# EAGLE design usbport-power-controller (EAGLE 9.6.2)
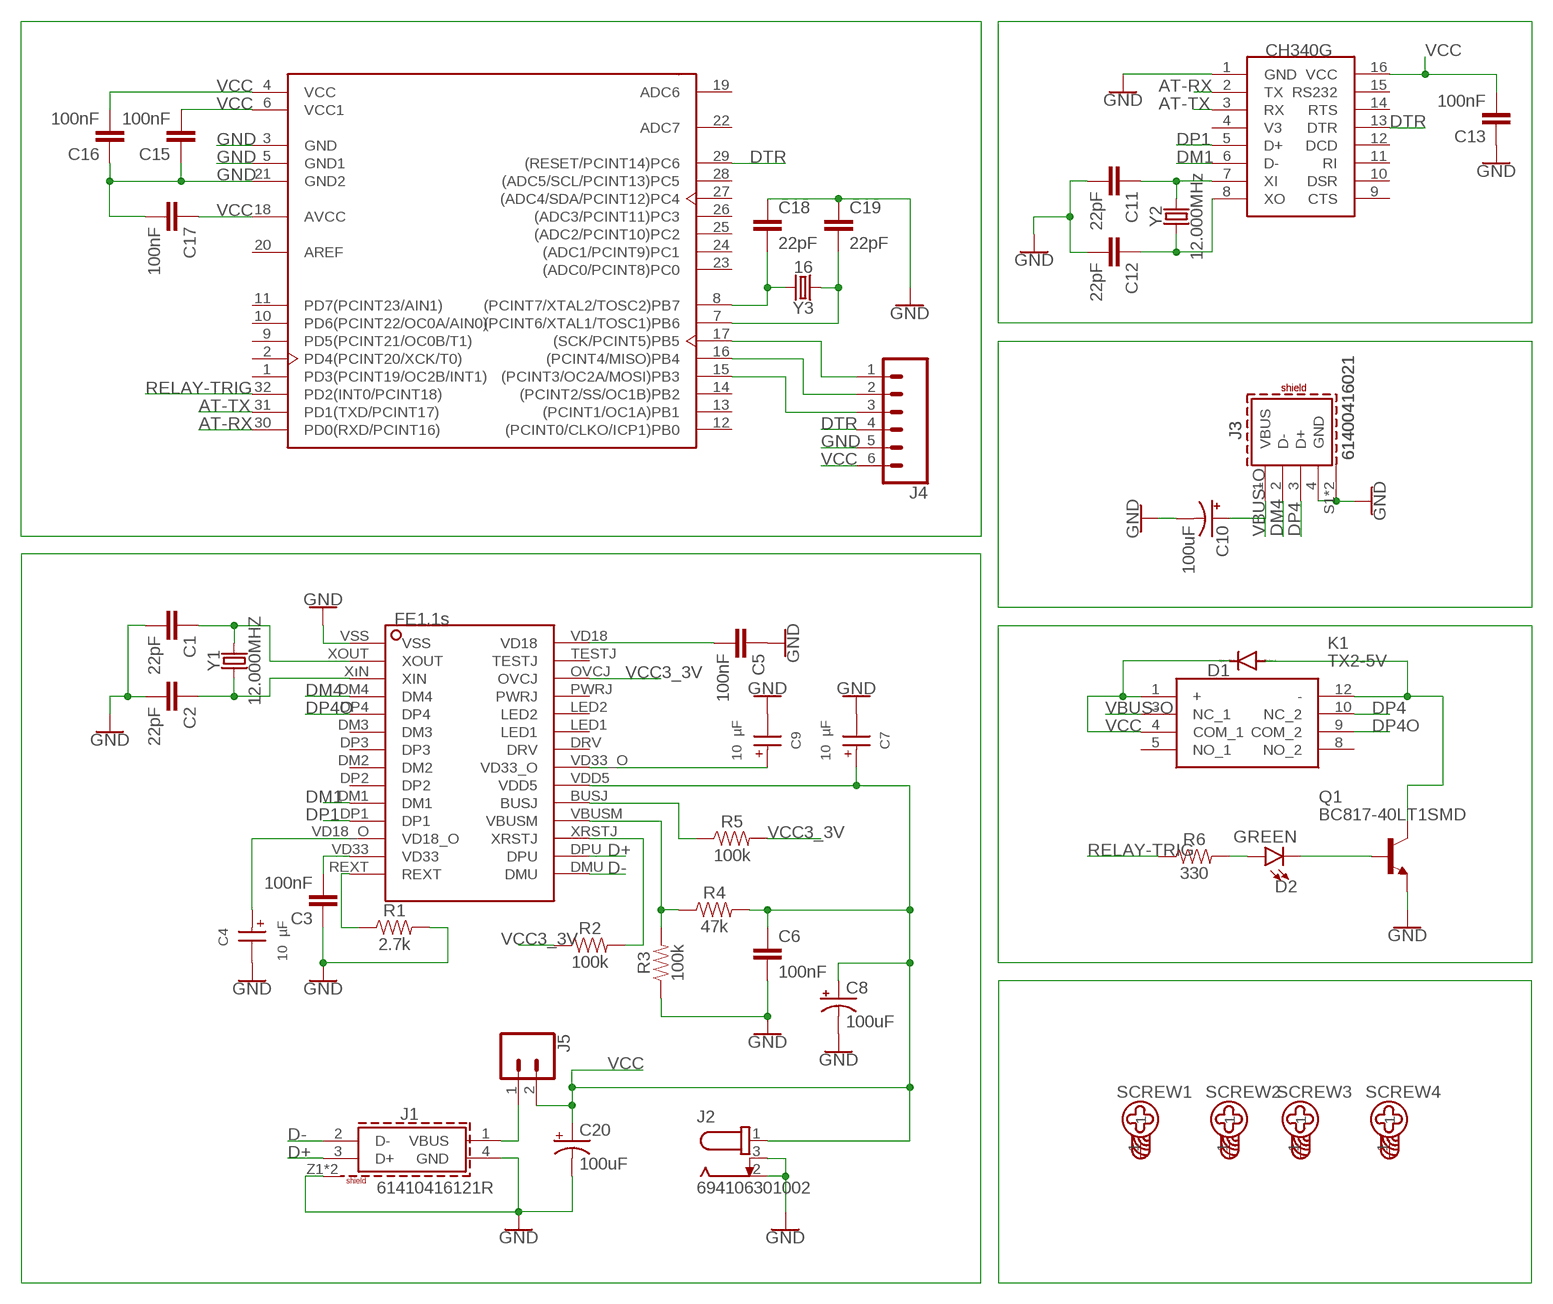
[diagram p0: schematic, sheet 1]

## Parts
ATMEGA328P-AU  ATMEGA328P-AU  [TQFP-32]
C1  22pF  10UF-1206-6.3V-20%  [1206]
C2  22pF  10UF-1206-6.3V-20%  [1206]
C3  100nF  1.0UF-1206-50V-10%  [1206]
C4  10 µF  WCAP-ASLI_4X5.5_865080340001  [WCAP-ASLI_4X5.5(DXL)]
C5  100nF  1.0UF-1206-50V-10%  [1206]
C6  100nF  1.0UF-1206-50V-10%  [1206]
C7  10 µF  WCAP-ASLI_4X5.5_865080340001  [WCAP-ASLI_4X5.5(DXL)]
C8  100uF  100UF-POLAR-25V-20%(ELEC)  [PANASONIC_D]
C9  10 µF  WCAP-ASLI_4X5.5_865080340001  [WCAP-ASLI_4X5.5(DXL)]
C10  100uF  100UF-POLAR-25V-20%(ELEC)  [PANASONIC_D]
C11  22pF  10UF-1206-6.3V-20%  [1206]
C12  22pF  10UF-1206-6.3V-20%  [1206]
C13  100nF  1.0UF-1206-50V-10%  [1206]
C15  100nF  1.0UF-1206-50V-10%  [1206]
C16  100nF  1.0UF-1206-50V-10%  [1206]
C17  100nF  1.0UF-1206-50V-10%  [1206]
C18  22pF  10UF-1206-6.3V-20%  [1206]
C19  22pF  10UF-1206-6.3V-20%  [1206]
C20  100uF  100UF-POLAR-25V-20%(ELEC)  [PANASONIC_D]
D1  DIODE-DO-214AC  [DO-214AC]
D2  GREEN  LED-GREEN1206  [LED-1206]
J1  61410416121R  [61410416121R]
J2  694106301002  [694106301002]
J3  61400416021  61400416021  [61400416021]
J4  CONN_06NO_SILK_FEMALE_PTH  [1X06_NO_SILK]
J5  CONN_02  [1X02]
K1  TX2-5V  [TX2-24V]
Q1  BC817-40LT1SMD  [SOT23-BEC]
R1  2.7k  RESISTOR1206  [1206]
R2  100k  RESISTOR1206  [1206]
R3  100k  RESISTOR1206  [1206]
R4  47k  RESISTOR1206  [1206]
R5  100k  RESISTOR1206  [1206]
R6  330  10OHM-1206-1/4W-1%  [1206]
SCREW1  4946  [4946]
SCREW2  4946  [4946]
SCREW3  4946  [4946]
SCREW4  4946  [4946]
U$1  FE1.1S  [FE1.1S]
U$2  CH340G  [SOIC16]
Y1  12.000MHZ  CRYSTALSMD-HC49UP  [HC49UP]
Y2  12.000MHz  CRYSTALSMD-HC49UP  [HC49UP]
Y3  16  CRYSTALSMD-HC49UP  [HC49UP]

## Nets
AT-RX: ATMEGA328P-AU.30(PD0(RXD/PCINT16)) U$2.2(TX)
AT-TX: ATMEGA328P-AU.31(PD1(TXD/PCINT17)) U$2.3(RX)
D+: J1.3(D+) U$1.DPU
D-: J1.2(D-) U$1.DMU
DM1: U$1.DM1 U$2.6(D-)
DM4: J3.2(D-) U$1.DM4
DP1: U$1.DP1 U$2.5(D+)
DP4: J3.3(D+) K1.10(NC_2)
DP4O: K1.9(COM_2) U$1.DP4
DTR: ATMEGA328P-AU.29((RESET/PCINT14)PC6) J4.4 U$2.13(DTR)
GND: ATMEGA328P-AU.3(GND) ATMEGA328P-AU.5(GND1) ATMEGA328P-AU.21(GND2) C1.2 C2.2 C3.1 C4.2(-) C5.1 C6.2 C7.2(-) C8.- C9.2(-) C10.- C11.2 C12.2 C13.1 C15.1 C16.1 C17.2 C18.1 C19.1 C20.- J1.4(GND) J1.Z1(SHIELD) J1.Z2(SHIELD) J2.2 J2.3 J3.4(GND) J3.S1(SHIELD) J3.S2(SHIELD) J4.5 Q1.E R1.2 R3.1 U$1.VSS U$2.1(GND)
N$1: C2.1 U$1.XıN(XIN) Y1.1
N$2: R2.2 U$1.XRSTJ
N$3: R3.2 R4.1 U$1.VBUSM
N$4: R1.1 U$1.REXT
N$5: C1.1 U$1.XOUT Y1.2
N$6: C3.2 U$1.VD33
N$7: R5.1 U$1.BUSJ
N$8: D1.A K1.12(-) Q1.C
N$9: C12.1 U$2.8(XO) Y2.1
N$10: C4.1(+) U$1.VD18_O
N$11: C11.1 U$2.7(XI) Y2.2
N$12: D2.C Q1.B
N$13: D2.A R6.2
N$14: ATMEGA328P-AU.8((PCINT7/XTAL2/TOSC2)PB7) C18.2 Y3.2
N$15: ATMEGA328P-AU.17((SCK/PCINT5)PB5) J4.1
N$16: ATMEGA328P-AU.7((PCINT6/XTAL1/TOSC1)PB6) C19.2 Y3.1
N$17: ATMEGA328P-AU.16((PCINT4/MISO)PB4) J4.2
N$18: ATMEGA328P-AU.15((PCINT3/OC2A/MOSI)PB3) J4.3
N$20: J1.1(VBUS) J5.1
N$21: C5.2 U$1.VD18
RELAY-TRIG: ATMEGA328P-AU.32(PD2(INT0/PCINT18)) R6.1
VBUS-O: C10.+ J3.1(VBUS) K1.3(NC_1)
VCC: ATMEGA328P-AU.4(VCC) ATMEGA328P-AU.6(VCC1) ATMEGA328P-AU.18(AVCC) C6.1 C7.1(+) C8.+ C13.2 C15.2 C16.2 C17.1 C20.+ D1.C J2.1 J4.6 J5.2 K1.1(+) K1.4(COM_1) R4.2 U$1.VDD5 U$2.16(VCC)
VCC3_3V: C9.1(+) R2.1 R5.2 U$1.OVCJ U$1.VD33_O
Unconnected: ATMEGA328P-AU.1(PD3(PCINT19/OC2B/INT1)) ATMEGA328P-AU.2(PD4(PCINT20/XCK/T0)) ATMEGA328P-AU.9(PD5(PCINT21/OC0B/T1)) ATMEGA328P-AU.10(PD6(PCINT22/OC0A/AIN0)) ATMEGA328P-AU.11(PD7(PCINT23/AIN1)) ATMEGA328P-AU.12((PCINT0/CLKO/ICP1)PB0) ATMEGA328P-AU.13((PCINT1/OC1A)PB1) ATMEGA328P-AU.14((PCINT2/SS/OC1B)PB2) ATMEGA328P-AU.19(ADC6) ATMEGA328P-AU.22(ADC7) ATMEGA328P-AU.23((ADC0/PCINT8)PC0) ATMEGA328P-AU.24((ADC1/PCINT9)PC1) ATMEGA328P-AU.25((ADC2/PCINT10)PC2) ATMEGA328P-AU.26((ADC3/PCINT11)PC3) ATMEGA328P-AU.27((ADC4/SDA/PCINT12)PC4) ATMEGA328P-AU.28((ADC5/SCL/PCINT13)PC5) K1.5(NO_1) K1.8(NO_2) SCREW1.1 SCREW2.1 SCREW3.1 SCREW4.1 U$1.DM2 U$1.DM3 U$1.DP2 U$1.DP3 U$1.DRV U$1.LED1 U$1.LED2 U$1.PWRJ U$1.TESTJ U$2.4(V3) U$2.9(CTS) U$2.10(DSR) U$2.11(RI) U$2.12(DCD) U$2.14(RTS) U$2.15(RS232)

## Power pins joined to a net without a drawn wire
AREF: ATMEGA328P-AU.20(AREF)

## Library data of the parts
ATMEGA328P-AU = Microcontroller:ATMEGA328P-AU: IC MCU 8BIT 32KB FLASH 32TQFP Manufacturer's datasheet <http://ww1.microchip.com/downloads/en/DeviceDoc/ATmega48A-PA-88A-PA-168A-PA-328-P-DS-DS40002061A.pdf>; CREATED_BY: PCBLayout.com; DIGIKEY_PART_NUMBER: ATMEGA328P-AU-ND; MANUFACTURER: Microchip Technology; MPN: ATMEGA328P-AU; PACKAGE: TQFP-32
C1 C2 C11 C12 C18 C19 = SparkFun-Capacitors:10UF: 10.0µF ceramic capacitors A capacitor is a passive two-terminal electrical component used to store electrical energy temporarily in an electric field.; PROD_ID: CAP-10057; VALUE: 10uF
C3 C5 C6 C13 C15-C17 = SparkFun-Capacitors:1.0UF: 1µF ceramic capacitors A capacitor is a passive two-terminal electrical component used to store electrical energy temporarily in an electric field.; PROD_ID: CAP-09822; VALUE: 1.0uF
C4 C7 C9 = 865080340001_Eagle_WCAP-ASLI_rev20a:WCAP-ASLI_4X5.5: WCAP-ASLI Aluminium Electrolytic Capacitors Low Impedance +105 °C Characteristics Low impedance product series Mounting style: V-Chip SMT Capacitance range: 0.1 µF ‒ 6800 µF Capacitance tolerance: ±20 % Voltage range (UR): 6.3 ‒ 100 V(DC) Operating temperature: -55 °C up to +105 °C Endurance: 2000 h @ +105 °C Dimensions (DxL) in mm: 4.0 x 5.5 up to 16.0 x 17.0 Recommended soldering: Reflow soldering Applications Low impedance, especially for filtering applications Input and output capacitor for switched-mode power supply Filtering Smoothing e.g. DC/DC converter, AC/DC converter, satellite receiver, control panel <https://www.we-online.com/catalog/media/o14723v209%20Family_WCAP-ASLI.jpg> Details see: https://www.we-online.com/catalog/en/WCAP-ASLI/ Updated by yingchun,Shan;2020-03-02 2020(C) Würth Elektronik; DATASHEET-URL: https://www.we-online.com/catalog/datasheet/865080340001.pdf; DF: 16%; DIAMETER: 4mm; I-LEAK: 3uA; I-RIPPLE: 80mA; L: 5.5mm; OPERATING-TEMPERATURE: -55 °C up to +105 °C; PART-NUMBER: 865080340001; TECHNICAL-REFERENCE: ASEB055100M016DVCTAB000; VR: 16V(DC)
C8 C10 C20 = SparkFun-Capacitors:100UF-POLAR: 100µF polarized capacitors A capacitor is a passive two-terminal electrical component used to store electrical energy temporarily in an electric field.; PROD_ID: CAP-12547
D1 = diode:DIODE-: DIODE
D2 = SparkFun-LED:LED-GREEN: Green SMD LED Used in manufacturing of various products at SparkFun Packages: 0603 - SMD 0603 package [Product Link] <http://www.futureelectronics.com/en/technologies/semiconductors/optoelectronics/leds/Pages/9894312-LTST-C190GKT.aspx?CrossPart=HSMG-C190&IM=0> LilyPad 1206 - SMD1206 LilyPad package [Product Link] <http://www.futureelectronics.com/en/Technologies/Product.aspx?ProductID=IN150NGHARVATEKCORPORATION2049943&IM=0> 1206 - SMD1206 package [Product Link] <http://www.futureelectronics.com/en/technologies/semiconductors/optoelectronics/leds/Pages/8315665-LTST-C150KGKT.aspx?IM=0> 1206 Bottom Mount -SMD 1206 Bottom Mount [Product Link] <http://www.digikey.com/product-detail/en/lite-on-inc/LTST-C230KGKT/160-1456-1-ND/386854> SparkFun Products: Pro Mini 328 -5V <https://www.sparkfun.com/products/821> RedBoard <https://www.sparkfun.com/products/12757> MP3 Trigger <https://www.sparkfun.com/products/13720> Makey Makey <https://www.sparkfun.com/products/11076>; PROD_ID: DIO-00862
J1 = Wurth_Connectors_WR-USB:61410416121R: WR-COM USB 2.0 Type B Horizontal THR Kind Properties Durability:1 500 Mating cycles Quality Class:1 500 Mating cycles Connector Type: USB 2.0 Gender:Receptacle Type:Horizontal General Information Operating Temperature:-55up to +85 °C Compliance:Lead free / RoHS Electrical Properties IR 1:1.5A Working Voltage:30V (AC) Withstanding Voltage:500V (AC) Contact Resistance:30 mΩ Material Properties Insulator Material:LCP Insulator Flammability Rating:UL94 V-0 Color:Black Contact Material:Copper Alloy Contact Plating: Selective Gold Contact Type:Stamped Shielding Material:Brass Shielding Plating:Nickel <https://www.we-online.com/catalog/media/o106784v209%20Family_WR-COM_61410416121R.jpg> Details see: https://www.we-online.com/catalog/en/COM_THR_TYPE_B_HORIZONTAL/ Updated by Ella Wu 2020-08-17 2020 (C) Würth Elektronik; APPLICATION: USB 2.0; DATASHEET-URL: https://www.we-online.com/catalog/datasheet/61410416121R.pdf; GERDER: Receptacle; INTERFACE-TYPE: Type B; IR1: 1.5A; MOUNT: THR; PACKAGING: Tape and Reel; PART-NUMBER: 61410416121R; PINS: 4; TYPE: Horizontal; WORKING-VOLTAGE: 30V(AC)
J2 = DC Power Jacks:694106301002: CONN PWR JACK 2.1X5.5MM SOLDER Manufacturer's datasheet <https://katalog.we-online.de/em/datasheet/6941xx301002.pdf>; CREATED_BY: PCBLayout.com; DIGIKEY_PART_NUMBER: 732-5930-ND; MANUFACTURER: Wurth Electronics Inc.; MPN: 694106301002
J3 = Wurth_Connectors_WR-USB:61400416021: WR-COM USB 2.0 Type A Horizontal Kind Properties Durability:1 500 Mating cycles Quality Class:1 500 Mating cycles Connector Type:USB Gender:Receptacle Type:Horizontal General Information Operating Temperature:-40up to +105 °C Compliance:RoHS Electrical Properties IR 1:1.5 A Working Voltage:30V (AC) Withstanding Voltage:750 V (AC) Contact Resistance:20 mΩ Material Properties Insulator Material:PBT Insulator Flammability Rating:UL94 V-0 Color:White Cover Material:Brass Cover Plating:Nickel Contact Material:Copper Alloy Contact Plating:Selective Gold Contact Type:Stamped Shielding Material:Brass Shielding Plating:Nickel <https://www.we-online.com/catalog/media/o32983v209%20Family_WR-COM_61400416021.jpg> Details see: https://www.we-online.com/catalog/en/COM_TYPE_A_HORIZONTAL/ Updated by Yingchun, Shan 2020-01-14 2020 (C) Würth Elektronik; APPLICATION: USB 2.0; DATASHEET-URL: https://www.we-online.com/catalog/datasheet/61400416021.pdf; GERDER: Receptacle; INTERFACE-TYPE: Type A; IR1: 1.5A; MOUNT: THT; PACKAGING: Tray; PART-NUMBER: 61400416021; PINS: 4; TYPE: Horizontal; WORKING-VOLTAGE: 30V(AC)
J4 = SparkFun-Connectors:CONN_06: Multi connection point. Often used as Generic Header-pin footprint for 0.1 inch spaced/style header connections On any of the 0.1 inch spaced packages, you can populate with these: Break Away Headers - Straight <https://www.sparkfun.com/products/116> (PRT-00116) Break Away Male Headers - Right Angle <https://www.sparkfun.com/products/553> (PRT-00553) Female Headers <https://www.sparkfun.com/products/115> (PRT-00115) Break Away Headers - Machine Pin <https://www.sparkfun.com/products/117> (PRT-00117) Break Away Female Headers - Swiss Machine Pin <https://www.sparkfun.com/products/743> (PRT-00743) Arduino Stackable Header - 6 Pin <https://www.sparkfun.com/products/9280> (PRT-09280) For SCREWTERMINALS and SPRING TERMINALS visit here: Screw Terimnals on SparkFun.com <https://www.sparkfun.com/search/results?term=Screw+Terminals> (5mm/3.5mm/2.54mm spacing) This device is also useful as a general connection point to wire up your design to another part of your project. Our various solder wires solder well into these plated through hole pads. Hook-Up Wire - Assortment (Stranded, 22 AWG) <https://www.sparkfun.com/products/11375> (PRT-11375) Hook-Up Wire - Assortment (Solid Core, 22 AWG) <https://www.sparkfun.com/products/11367> (PRT-11367) View the entire wire category on our website here <https://www.sparkfun.com/categories/141>; PROD_ID: CONN-08437
J5 = SparkFun-Connectors:CONN_02: Multi connection point. Often used as Generic Header-pin footprint for 0.1 inch spaced/style header connections On any of the 0.1 inch spaced packages, you can populate with these: Break Away Headers - Straight <https://www.sparkfun.com/products/116> (PRT-00116) Break Away Male Headers - Right Angle <https://www.sparkfun.com/products/553> (PRT-00553) Female Headers <https://www.sparkfun.com/products/115> (PRT-00115) Break Away Headers - Machine Pin <https://www.sparkfun.com/products/117> (PRT-00117) Break Away Female Headers - Swiss Machine Pin <https://www.sparkfun.com/products/743> (PRT-00743) For SCREWTERMINALS and SPRING TERMINALS visit here: Screw Terimnals on SparkFun.com <https://www.sparkfun.com/search/results?term=Screw+Terminals> (5mm/3.5mm/2.54mm spacing) This device is also useful as a general connection point to wire up your design to another part of your project. Our various solder wires solder well into these plated through hole pads. Hook-Up Wire - Assortment (Stranded, 22 AWG) <https://www.sparkfun.com/products/11375> (PRT-11375) Hook-Up Wire - Assortment (Solid Core, 22 AWG) <https://www.sparkfun.com/products/11367> (PRT-11367) View the entire wire category on our website here <https://www.sparkfun.com/categories/141> Special notes: Molex polarized connector foot print use with: PRT-08233 with associated crimp pins and housings. 2.54_SCREWTERM for use with PRT-10571. 3.5mm Screw Terminal footprints for PRT-08084 5mm Screw Terminal footprints for use with PRT-08432
K1 = TX2-5V:TX2-5V: Low Signal Relays - PCB 2A 5VDC DPDT NON-LATCHING PCB Source: Datasheet <https://www.panasonic-electric-works.com/pew/hu/downloads/ds_61022_en_tx.pdf>; DESCRIPTION: Low Signal Relays - PCB 2A 5VDC DPDT NON-LATCHING PCB; HEIGHT: mm; MANUFACTURER_NAME: Panasonic; MANUFACTURER_PART_NUMBER: TX2-5V; MOUSER_PART_NUMBER: 769-TX2-5V; MOUSER_PRICE-STOCK: https://www.mouser.co.uk/ProductDetail/Panasonic-Industrial-Devices/TX2-5V?qs=HLLy2pIPwuvI6H6PvuEgKw%3D%3D
Q1 = transistor-npn:BC817*: NPN Transistor
R1-R5 = SparkFun-Resistors:RESISTOR: Generic Resistor Package
R6 = SparkFun-Resistors:10OHM: 10Ω resistor A resistor is a passive two-terminal electrical component that implements electrical resistance as a circuit element. Resistors act to reduce current flow, and, at the same time, act to lower voltage levels within circuits. - Wikipedia; PROD_ID: RES-08705; VALUE: 10
SCREW1-SCREW4 = PlasticScrew:4946: Standoffs & Spacers M/F NYLON STANDOFF 4-40 1.00 L Source: Datasheet <https://componentsearchengine.com/Datasheets/1/4946.pdf>; DESCRIPTION: Standoffs & Spacers M/F NYLON STANDOFF 4-40 1.00 L; HEIGHT: 25.78mm; MANUFACTURER_NAME: Keystone Electronics; MANUFACTURER_PART_NUMBER: 4946; MOUSER_PART_NUMBER: 534-4946; MOUSER_PRICE-STOCK: https://www.mouser.com/Search/Refine.aspx?Keyword=534-4946
U$1 = TERMINUS-USB-FE1.1S:FE1.1S
U$2 = ch340g:CH340G
Y1-Y3 = SparkFun-Clocks:CRYSTAL: Crystals (Generic) These are passive quartz crystals, which can be used as a clock source for a microcontroller. Crystal's are two-terminal devices. They require external "load" capacitors to generate an oscillating signal.

## Net classes
0 default: clearance 0.205 mm

## Board
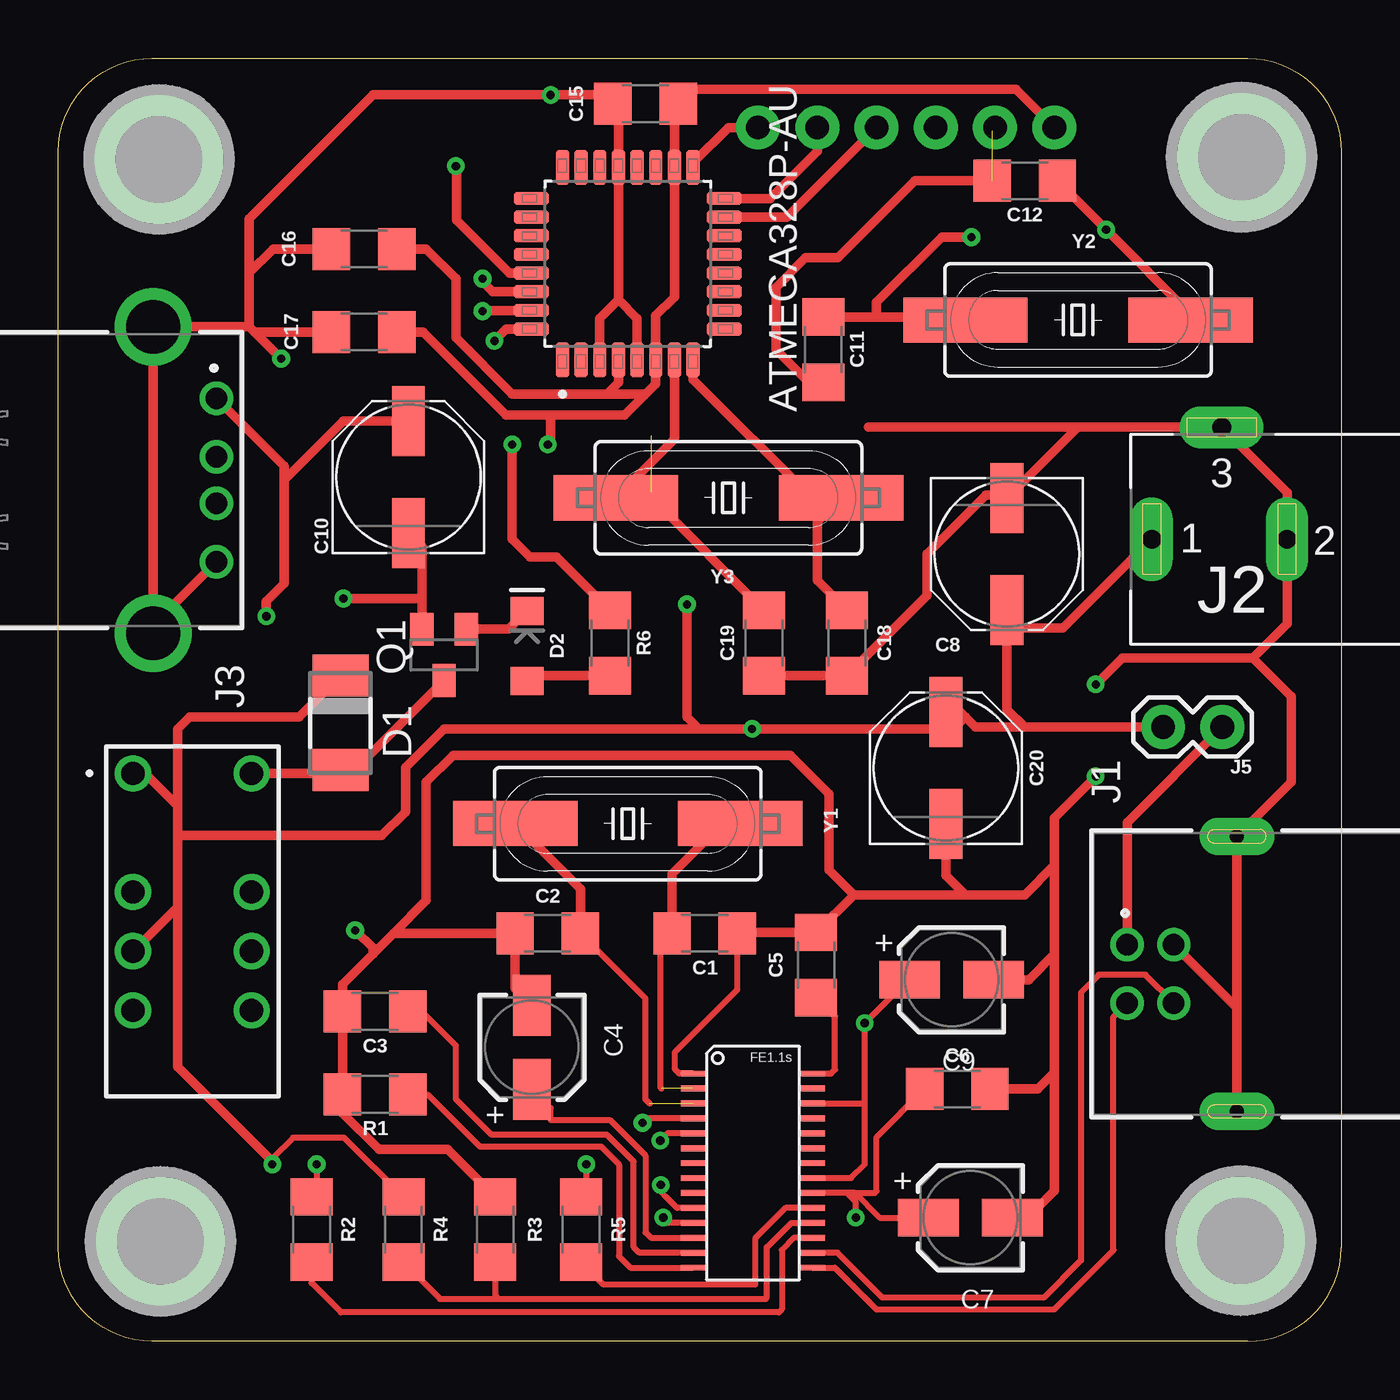
[diagram p1: board, top side]
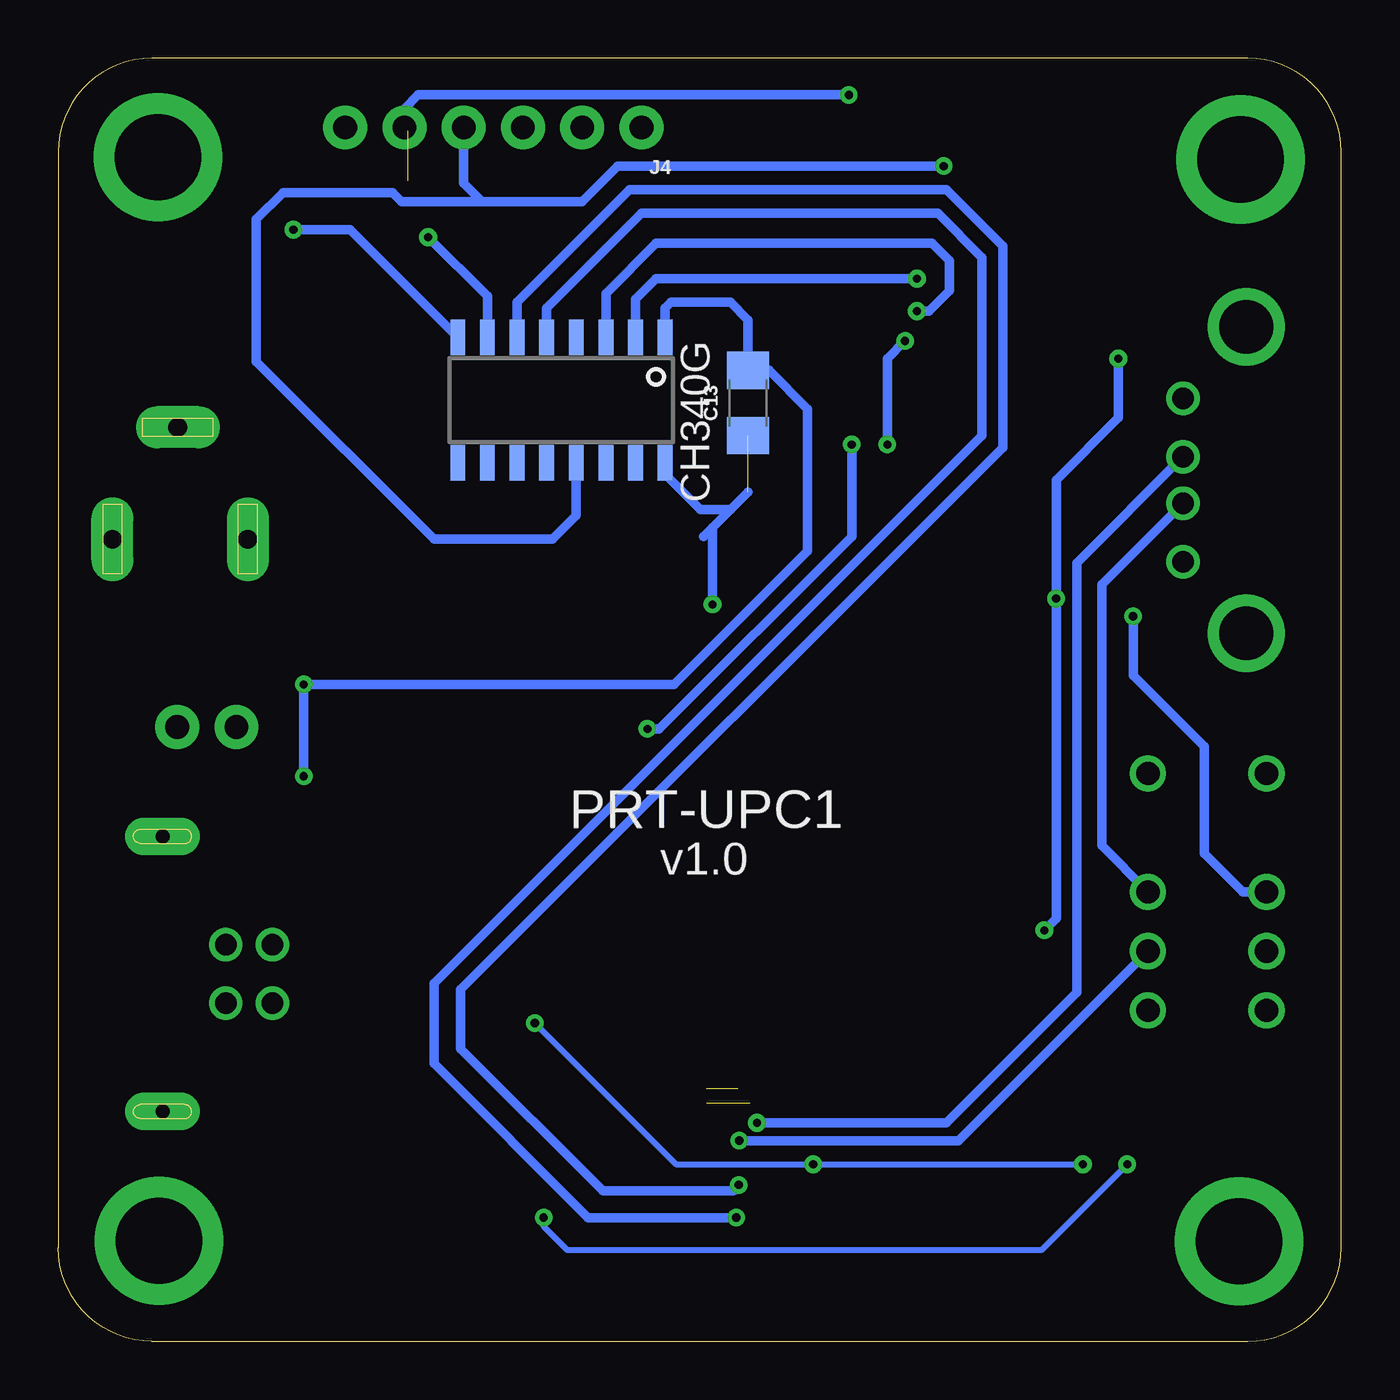
[diagram p2: board, bottom side, seen from below]

Size 55 x 55 mm. Coordinates in mm from the lower left corner, seen from the top.
Outline: 51,0 arc90 55,4 55,51 arc90 51,55 4,55 arc90 0,51 0,4 arc90 4,0 51,0
Copper layers (1*16): Top 0.035mm / dielectric 1.5mm / Bottom 0.035mm
Design rules "default": minimum track width 6mil, minimum drill 0.35mm, track to track 6mil, track to pad 6mil, pad to pad 6mil, via to via 6mil, smd to smd 6mil, copper to edge 40mil, drill to drill 6mil, minimum pad ring 10mil, minimum via ring 8mil, stop-mask expansion 4mil, vias tented up to drill 0mil, thermal gap 10mil

### Footprints (pad centres in the part's own frame; a part is rotated, then mirrored left to right if it is on the bottom)
TQFP-32 = smd 1.5 x 0.57: 1 -4.13,2.8; 2 -4.13,2; 3 -4.13,1.2; 4 -4.13,0.4; 5 -4.13,-0.4; 6 -4.13,-1.2; 7 -4.13,-2; 8 -4.13,-2.8; 17 4.13,-2.8; 18 4.13,-2; 19 4.13,-1.2; 20 4.13,-0.4; 21 4.13,0.4; 22 4.13,1.2; 23 4.13,2; 24 4.13,2.8 | smd 0.57 x 1.5: 9 -2.8,-4.13; 10 -2,-4.13; 11 -1.2,-4.13; 12 -0.4,-4.13; 13 0.4,-4.13; 14 1.2,-4.13; 15 2,-4.13; 16 2.8,-4.13; 25 2.8,4.13; 26 2,4.13; 27 1.2,4.13; 28 0.4,4.13; 29 -0.4,4.13; 30 -1.2,4.13; 31 -2,4.13; 32 -2.8,4.13
1206 = smd 1.6 x 1.8: 1 -1.4,0; 2 1.4,0
WCAP-ASLI_4X5.5(DXL) = smd 2.6 x 1.6: 1 1.8,0; 2 -1.8,0
PANASONIC_D = smd 3 x 1.4: + 2.4,0; - -2.4,0
DO-214AC = smd 1.8 x 2.4: A 2.025,0; C -2.025,0
LED-1206 = smd 1.2 x 1.4: A -1.5,0; C 1.5,0
61410416121R = drill 0.92: 1 1.25,6.86; 2 -1.25,6.86; 3 -1.25,4.86; 4 1.25,4.86 | drill 0.6 pad 1.6 long: Z1 -5.9,2.15; Z2 5.9,2.15
694106301002 = drill 0.8 pad 1.8 long: 1 13.6,0; 2 7.8,0; 3 10.6,-4.8
61400416021 = drill 0.92: 1 -3.5,5.99; 2 -1,5.99; 3 1,5.99; 4 3.5,5.99 | drill 2.3: S1 -6.57,3.28; S2 6.57,3.28
1X06_NO_SILK = drill 1.016 pad 1.88: 1 0,0; 2 2.54,0; 3 5.08,0; 4 7.62,0; 5 10.16,0; 6 12.7,0
1X02 = drill 1.016 pad 1.88: 1 0,0; 2 2.54,0
TX2-24V = drill 1 pad 1.55: 1 1.15,-2.54; 3 6.23,-2.54; 4 8.77,-2.54; 5 11.31,-2.54; 8 11.31,2.54; 9 8.77,2.54; 10 6.23,2.54; 12 1.15,2.54
SOT23-BEC = smd 1 x 1.4: B -0.95,-1.1; C 0,1.1; E 0.95,-1.1
4946 = drill 3.7 pad 5.5: 1 0,0
FE1.1S = smd 1.05 x 0.25: BUSJ 2.56,-1.92; DM1 -2.56,-1.92; DM2 -2.56,-0.64; DM3 -2.56,0.64; DM4 -2.56,1.92; DMU 2.56,-4.48; DP1 -2.56,-2.56; DP2 -2.56,-1.28; DP3 -2.56,0; DP4 -2.56,1.28; DPU 2.56,-3.84; DRV 2.56,0; LED1 2.56,0.64; LED2 2.56,1.28; OVCJ 2.56,2.56; PWRJ 2.56,1.92; REXT -2.56,-4.48; TESTJ 2.56,3.2; VBUSM 2.56,-2.56; VD18 2.56,3.84; VD18_O -2.56,-3.2; VD33 -2.56,-3.84; VD33_O 2.56,-0.64; VDD5 2.56,-1.28; VSS -2.56,3.84; XOUT -2.56,3.2; XRSTJ 2.56,-3.2; XıN -2.56,2.56
SOIC16 = smd 0.635 x 1.524: 1 -4.445,-2.695; 2 -3.175,-2.695; 3 -1.905,-2.695; 4 -0.635,-2.695; 5 0.635,-2.695; 6 1.905,-2.695; 7 3.175,-2.695; 8 4.445,-2.695; 9 4.445,2.695; 10 3.175,2.695; 11 1.905,2.695; 12 0.635,2.695; 13 -0.635,2.695; 14 -1.905,2.695; 15 -3.175,2.695; 16 -4.445,2.695
HC49UP = smd 5.334 x 1.93: 1 -4.826,0; 2 4.826,0

### Placement (x,y rotation side)
ATMEGA328P-AU  24.41,46.19 90 top
C1  27.71,17.49 0 top
C2  20.98,17.49 180 top
C3  13.58,14.14 0 top
C4  20.3,12.6 270 top
C5  32.49,16.12 270 top
C6  38.54,10.81 0 top
C7  39.1,5.3 180 top
C8  40.67,33.74 270 top
C9  38.3,15.5 180 top
C10  15.01,37.05 90 top
C11  32.79,42.51 270 top
C12  41.43,49.75 180 top
C13  25.43,40.22 270 bottom
C15  25.17,53.05 0 top
C16  13.11,46.83 0 top
C17  13.11,43.27 180 top
C18  33.81,29.93 90 top
C19  30.25,29.93 90 top
C20  38.05,24.57 90 top
D1  12.09,26.51 270 top
D2  20.09,29.81 90 top
J1  52.68,15.74 90 top
J2  60.48,34.38 180 top
J3  0.79,36.92 270 top
J4  30,52.03 180 bottom
J5  49.91,26.33 180 top
K1  5.74,25.49 270 top
Q1  16.54,29.43 180 top
R1  13.58,10.58 180 top
R2  10.86,4.79 270 top
R3  18.73,4.79 270 top
R4  14.79,4.79 90 top
R5  22.41,4.79 90 top
R6  23.65,29.93 270 top
SCREW1  4.38,4.28 0 top
SCREW2  50.69,4.31 0 top
SCREW3  50.73,50.76 0 top
SCREW4  4.32,50.67 0 top
U$1  29.78,7.63 0 top
U$2  33.43,40.35 180 bottom
Y1  24.41,22.19 0 top
Y2  43.72,43.78 180 top
Y3  28.73,36.16 0 top

### Tracks (layer width: path | path; a pad name or v marks a point on that pad's centre or on a via)
AT-RX  (via drill 0.35)
  Top 0.406: ATMEGA328P-AU.30 18.63,44.99 18.19,45.43 v18.19,45.56
  Bottom 0.406: U$2.2 30.25,44.67 29.36,45.56 v18.19,45.56
AT-TX  (via drill 0.35)
  Top 0.406: ATMEGA328P-AU.31 18.22,44.19 v18.19,44.16
  Bottom 0.406: U$2.3 31.52,44.92 29.36,47.08 17.55,47.08 16.79,46.32 16.79,45.05 17.68,44.16 v18.19,44.16
D+
  Top 0.254: J1.3 46.6,15.71 44.6,15.71 43.84,14.95 43.84,3.46 42.24,1.87 35.34,1.87 33.41,3.79 U$1.DPU
D-
  Top 0.254: J1.2 45.24,13.91 45.24,3.9 42.7,1.36 35.08,1.36 33.29,3.15 U$1.DMU
DM1  (via drill 0.35)
  Top 0.254: U$1.DM1 26.54,5.71 26.12,6.12 26.06,6.19 25.83,6.42 v25.83,6.7
  Bottom 0.406: U$2.6 35.33,44.54 30.51,49.37 16.92,49.37 14.51,46.95 14.51,38.32 37.75,15.08 37.75,12.54 31.65,6.44 26.06,6.44 25.83,6.67 v25.83,6.7
DM4  (via drill 0.35)
  Top 0.254: U$1.DM4 25.24,9.55 v25.05,9.36
  Bottom 0.406: J3.2 11.33,33.37 11.33,14.95 16.92,9.36 v25.05,9.36
DP1  (via drill 0.35)
  Top 0.254: U$1.DP1 26.16,5.07 v25.94,5.3
  Bottom 0.406: U$2.5 34.06,44.29 30,48.35 17.3,48.35 15.39,46.45 15.39,38.83 38.89,15.33 38.89,11.9 32.29,5.3 v25.94,5.3
DP4
  Bottom 0.406: K1.10 10.27,21.25 10.27,32.43 J3.3
DP4O  (via drill 0.35)
  Top 0.254: U$1.DP4 26.12,8.91 v25.81,8.6
  Bottom 0.406: v25.81,8.6 16.41,8.6 K1.9
DTR  (via drill 0.35)
  Top 0.406: ATMEGA328P-AU.29 19.35,45.79 17.07,48.07 17.07,50.36 v17.05,50.38
  Bottom 0.406: 32.79,35.77 U$2.13 32.79,35.4 33.81,34.38 38.89,34.38 46.51,42 46.51,48.1 45.37,49.24 40.67,49.24 40.29,48.86 36.83,48.86 | 36.83,48.86 32.54,48.86 31.02,50.38 v17.05,50.38 | J4.4 37.62,49.65 36.83,48.86
GND  (via drill 0.35)  (1 unrouted)
  Top 0.254: U$1.VSS 26.62,11.47 26.44,11.65 26.44,12.41 29.11,15.08 C1.2
  Top 0.406: R3.1 16.7,8.22 13.74,8.22 12.18,9.78 R1.2 C3.1 12.18,15.29 13.49,16.6 | 14.38,17.49 C2.2 19.58,15.12 C4.2 | 13.49,16.6 14.38,17.49 | C1.2 29.15,17.52 C5.1 34.1,19.14 | 42.7,16.6 41.6,15.5 C9.2 | 34.1,19.14 38.89,19.14 | 38.89,19.14 41.43,19.14 42.7,20.41 | J1.Z1 50.53,14.28 | 50.53,14.28 J1.4 | 50.53,14.28 J1.Z2 52.86,23.97 52.86,27.65 51.21,29.3 | 14.38,17.49 15.78,18.89 15.78,23.97 16.92,25.11 31.4,25.11 33.05,23.46 33.05,20.2 34.1,19.14 | 42.7,16.6 42.7,20.41 | 42.7,20.41 42.7,22.44 v44.48,24.22 | C20.- 38.05,19.98 38.89,19.14 | v44.48,28.16 45.62,29.3 51.21,29.3 | J3.4 4.07,30.71 | 4.07,30.71 J3.S2 | 4.07,30.71 J3.S1 8.19,43.49 | C10.- 15.59,34.07 15.59,31.84 | 15.59,31.84 Q1.E | 51.21,29.3 52.68,30.77 J2.2 52.68,36.38 J2.3 43.7,39.18 | C8.- 40.8,36.28 | 40.8,36.28 43.7,39.18 | 42.7,16.6 42.7,11.52 | 42.7,11.52 42.7,6.44 41.56,5.3 C7.2 | C6.2 41.99,10.81 42.7,11.52 | 13.49,16.6 13.49,16.85 v12.73,17.62 | v9.55,42.13 8.41,43.27 | 15.59,31.84 v12.22,31.84 | ATMEGA328P-AU.3 23.21,43.85 24.01,44.65 | ATMEGA328P-AU.5 24.81,43.85 24.01,44.65 | 24.01,44.65 ATMEGA328P-AU.21 24.01,52.81 C15.1 23.39,53.43 v21.11,53.43 13.49,53.43 8.19,48.13 8.19,45.81 | 8.19,45.81 8.19,43.49 | C16.1 9.21,46.83 8.19,45.81 | C17.2 8.41,43.27 | 8.41,43.27 8.19,43.49 | C19.1 C18.1 37.24,31.96 37.24,33.74 39.77,36.28 40.8,36.28 | 43.7,39.18 34.72,39.18 | 40.03,51.9 J4.5 | C12.2 36.73,49.75 33.43,46.45 32.03,46.45 30.76,45.17 30.76,42.51 32.16,41.11 C11.2
  Bottom 0.406: v44.48,24.22 v44.48,28.16 28.6,28.16 22.89,33.87 22.89,39.97 24.54,41.62 C13.1 25.43,43.78 26.19,44.54 28.73,44.54 28.98,44.29 U$2.1 | v12.73,17.62 12.22,18.12 v12.22,31.84 12.22,36.92 9.55,39.59 v9.55,42.13 | v21.11,53.43 39.57,53.43 40.16,52.84 J4.5
N$1  (1 unrouted)
  Top 0.254: 25.36,10.19 25.17,10.38 25.17,14.7 C2.1
  Top 0.406: Y1.1 22.38,19.39 C2.1
N$2
  Top 0.254: U$1.XRSTJ 31.55,4.43 31.02,3.9 31.02,1.36 30.89,1.24 12.12,1.24 10.86,2.5 R2.2
N$3
  Top 0.254: R4.1 16.36,1.81 18.88,1.81 | U$1.VBUSM 31.43,5.07 30.38,4.03 30.38,1.87 30.33,1.81 18.88,1.81 | R3.2 18.73,1.96 18.88,1.81
N$4
  Top 0.254: R1.1 15.83,10.58 18.06,8.35 23.27,8.35 24.03,7.58 24.03,3.65 24.52,3.15 U$1.REXT
N$5  (1 unrouted)
  Top 0.254: 25.86,10.83 25.81,10.88 25.81,16.98 C1.1
  Top 0.406: C1.1 26.31,20.03 28.48,22.19 Y1.2
N$6
  Top 0.254: C3.2 15.57,14.14 17.05,12.66 17.05,10.38 18.57,8.85 23.52,8.85 24.67,7.71 24.67,4.03 24.9,3.79 U$1.VD33
N$7
  Top 0.254: U$1.BUSJ 31.18,5.71 29.87,4.41 29.87,2.42 23.38,2.42 R5.1
N$8
  Top 0.406: K1.12 11.95,24.34 | 11.95,24.34 D1.A | Q1.C 12.55,24.34 11.95,24.34
N$9  (via drill 0.35)
  Top 0.406: Y2.1 48.54,44.03 v44.92,47.65 C12.1
  Bottom 0.406: U$2.8 42.48,47.65 v44.92,47.65
N$10
  Top 0.254: U$1.VD18_O 25.4,4.43 25.17,4.66 25.17,7.96 23.65,9.49 21.11,9.49 21.11,9.99 C4.1
N$11  (via drill 0.35)
  Top 0.406: Y2.2 38.76,43.91 35.08,43.91 | 35.08,43.91 C11.1 | 35.08,43.91 35.08,44.54 37.87,47.33 v39.14,47.33
  Bottom 0.406: v39.14,47.33 36.6,44.79 U$2.7
N$12
  Top 0.406: D2.C 19.31,30.53 Q1.B
N$13
  Top 0.406: D2.A 20.32,28.54 R6.2
N$14
  Top 0.406: C18.2 32.54,32.6 32.54,35.14 Y3.2 32.29,36.16 27.21,41.23 ATMEGA328P-AU.8
N$15
  Top 0.406: ATMEGA328P-AU.17 27.21,50.52 28.73,52.03 J4.1
N$16
  Top 0.406: ATMEGA328P-AU.7 26.41,38.67 Y3.1 25.43,36.16 C19.2
N$17
  Top 0.406: J4.2 32.54,51.02 30.51,48.99 ATMEGA328P-AU.16
N$18
  Top 0.406: ATMEGA328P-AU.15 31.24,48.19 J4.3
N$20
  Top 0.406: J1.1 45.82,22.24 J5.1
N$21
  Top 0.254: U$1.VD18 33.13,11.47 33.3,11.65 33.3,13.91 C5.2
RELAY-TRIG  (via drill 0.35)
  Top 0.406: ATMEGA328P-AU.32 19.2,43.39 v18.7,42.89 | R6.1 21.37,33.62 20.22,33.62 19.46,34.38 v19.46,38.44
  Bottom 0.406: v19.46,38.44 19.46,42.13 v18.7,42.89
VBUS-O  (via drill 0.35)
  Top 0.406: J3.1 9.68,37.52 9.68,36.92 | 9.68,36.92 9.68,32.48 8.92,31.71 v8.92,31.08 | 9.68,36.92 12.21,39.45 C10.+
  Bottom 0.406: v8.92,31.08 8.92,28.54 5.87,25.49 5.87,20.92 4.21,19.26 K1.3
VCC  (via drill 0.35)  (1 unrouted)
  Top 0.254: 34.15,6.35 33.81,6.35 | 33.81,6.35 U$1.VDD5 | 34.15,6.35 35.2,5.3 C7.1 | 34.15,6.35 34.99,6.35 35.08,6.44 35.08,8.75 C6.1 | R4.2 12.25,8.73 10.06,8.73 9.17,7.84 9.17,7.71 v9.17,7.58 | v34.19,5.3 34.19,5.97 33.81,6.35
  Top 0.406: J5.2 41.43,26.33 | 41.43,26.33 39.32,26.33 38.89,26.76 | 38.89,26.76 37.62,28.03 37.62,27.4 C20.+ | 38.89,26.76 38.38,26.25 v29.75,26.25 27.46,26.25 | 27.46,26.25 16.54,26.25 14.89,24.6 14.89,22.7 13.87,21.68 5.11,21.68 | K1.4 5.11,18.63 | D1.C 10.32,26.76 5.62,26.76 5.11,26.25 5.11,22.95 | 5.11,22.95 5.11,21.68 | 5.11,21.68 5.11,18.63 | K1.1 3.72,24.34 5.11,22.95 | C8.+ 40.67,30.57 | 40.67,30.57 40.67,27.09 41.43,26.33 | J2.1 43.07,30.57 40.67,30.57 | C16.2 15.78,46.83 17.05,45.56 17.05,43.02 19.46,40.6 23.52,40.6 | ATMEGA328P-AU.4 24.01,41.09 23.52,40.6 | 25.11,40.54 25.61,41.04 ATMEGA328P-AU.6 25.61,43.96 26.41,44.76 ATMEGA328P-AU.18 26.41,52.89 C15.2 27.21,53.68 41.05,53.68 J4.6 | 25.11,40.54 24.29,39.71 21.11,39.71 | 21.11,39.71 19.2,39.71 15.65,43.27 C17.1 | 27.46,26.25 26.95,26.76 v26.95,31.59 | 5.11,18.63 5.11,11.77 9.17,7.71 | 23.52,40.6 25.05,40.6 25.11,40.54 | 21.11,39.71 21.11,38.57 v20.98,38.44
  Bottom 0.254: v9.17,7.58 12.86,3.9 33.17,3.9 34.19,4.92 v34.19,5.3
  Bottom 0.406: 25.43,36.41 26.19,35.65 | 26.19,35.65 27.46,35.65 28.98,37.17 U$2.16 | 27.33,34.51 26.95,34.89 | v26.95,31.59 26.95,34.89 | 26.95,34.89 26.19,35.65 | v20.98,38.44 20.98,34.51 29.24,26.25 v29.75,26.25
VCC3_3V  (via drill 0.35)
  Top 0.254: U$1.VD33_O 33.98,6.99 34.57,7.58 34.57,10.12 | 34.57,10.12 v34.57,13.64 36.43,15.5 C9.1 | U$1.OVCJ 34.5,10.19 34.57,10.12 | v22.63,7.58 22.63,6.41 R5.2 | v11.08,7.58 11.08,6.41 R2.1
  Bottom 0.254: v34.57,13.64 28.52,7.58 v22.63,7.58 v11.08,7.58

### Text on the board
bPlace: PRT-UPC1 | v1.0